# Altium schematic sheet ASCII_09_FPGA_banks_5_6_7_8.SchDoc: FPGA banks 5, 6, 7, 8
size A3; Organization: Lime Microsystems; Address1: Surrey Tech Centre; Address2: Guildford GU2 7YG; Address3: Surrey; Address4: United Kingdom; Revision: v1.4s; SheetNumber: 9; SheetTotal: 15
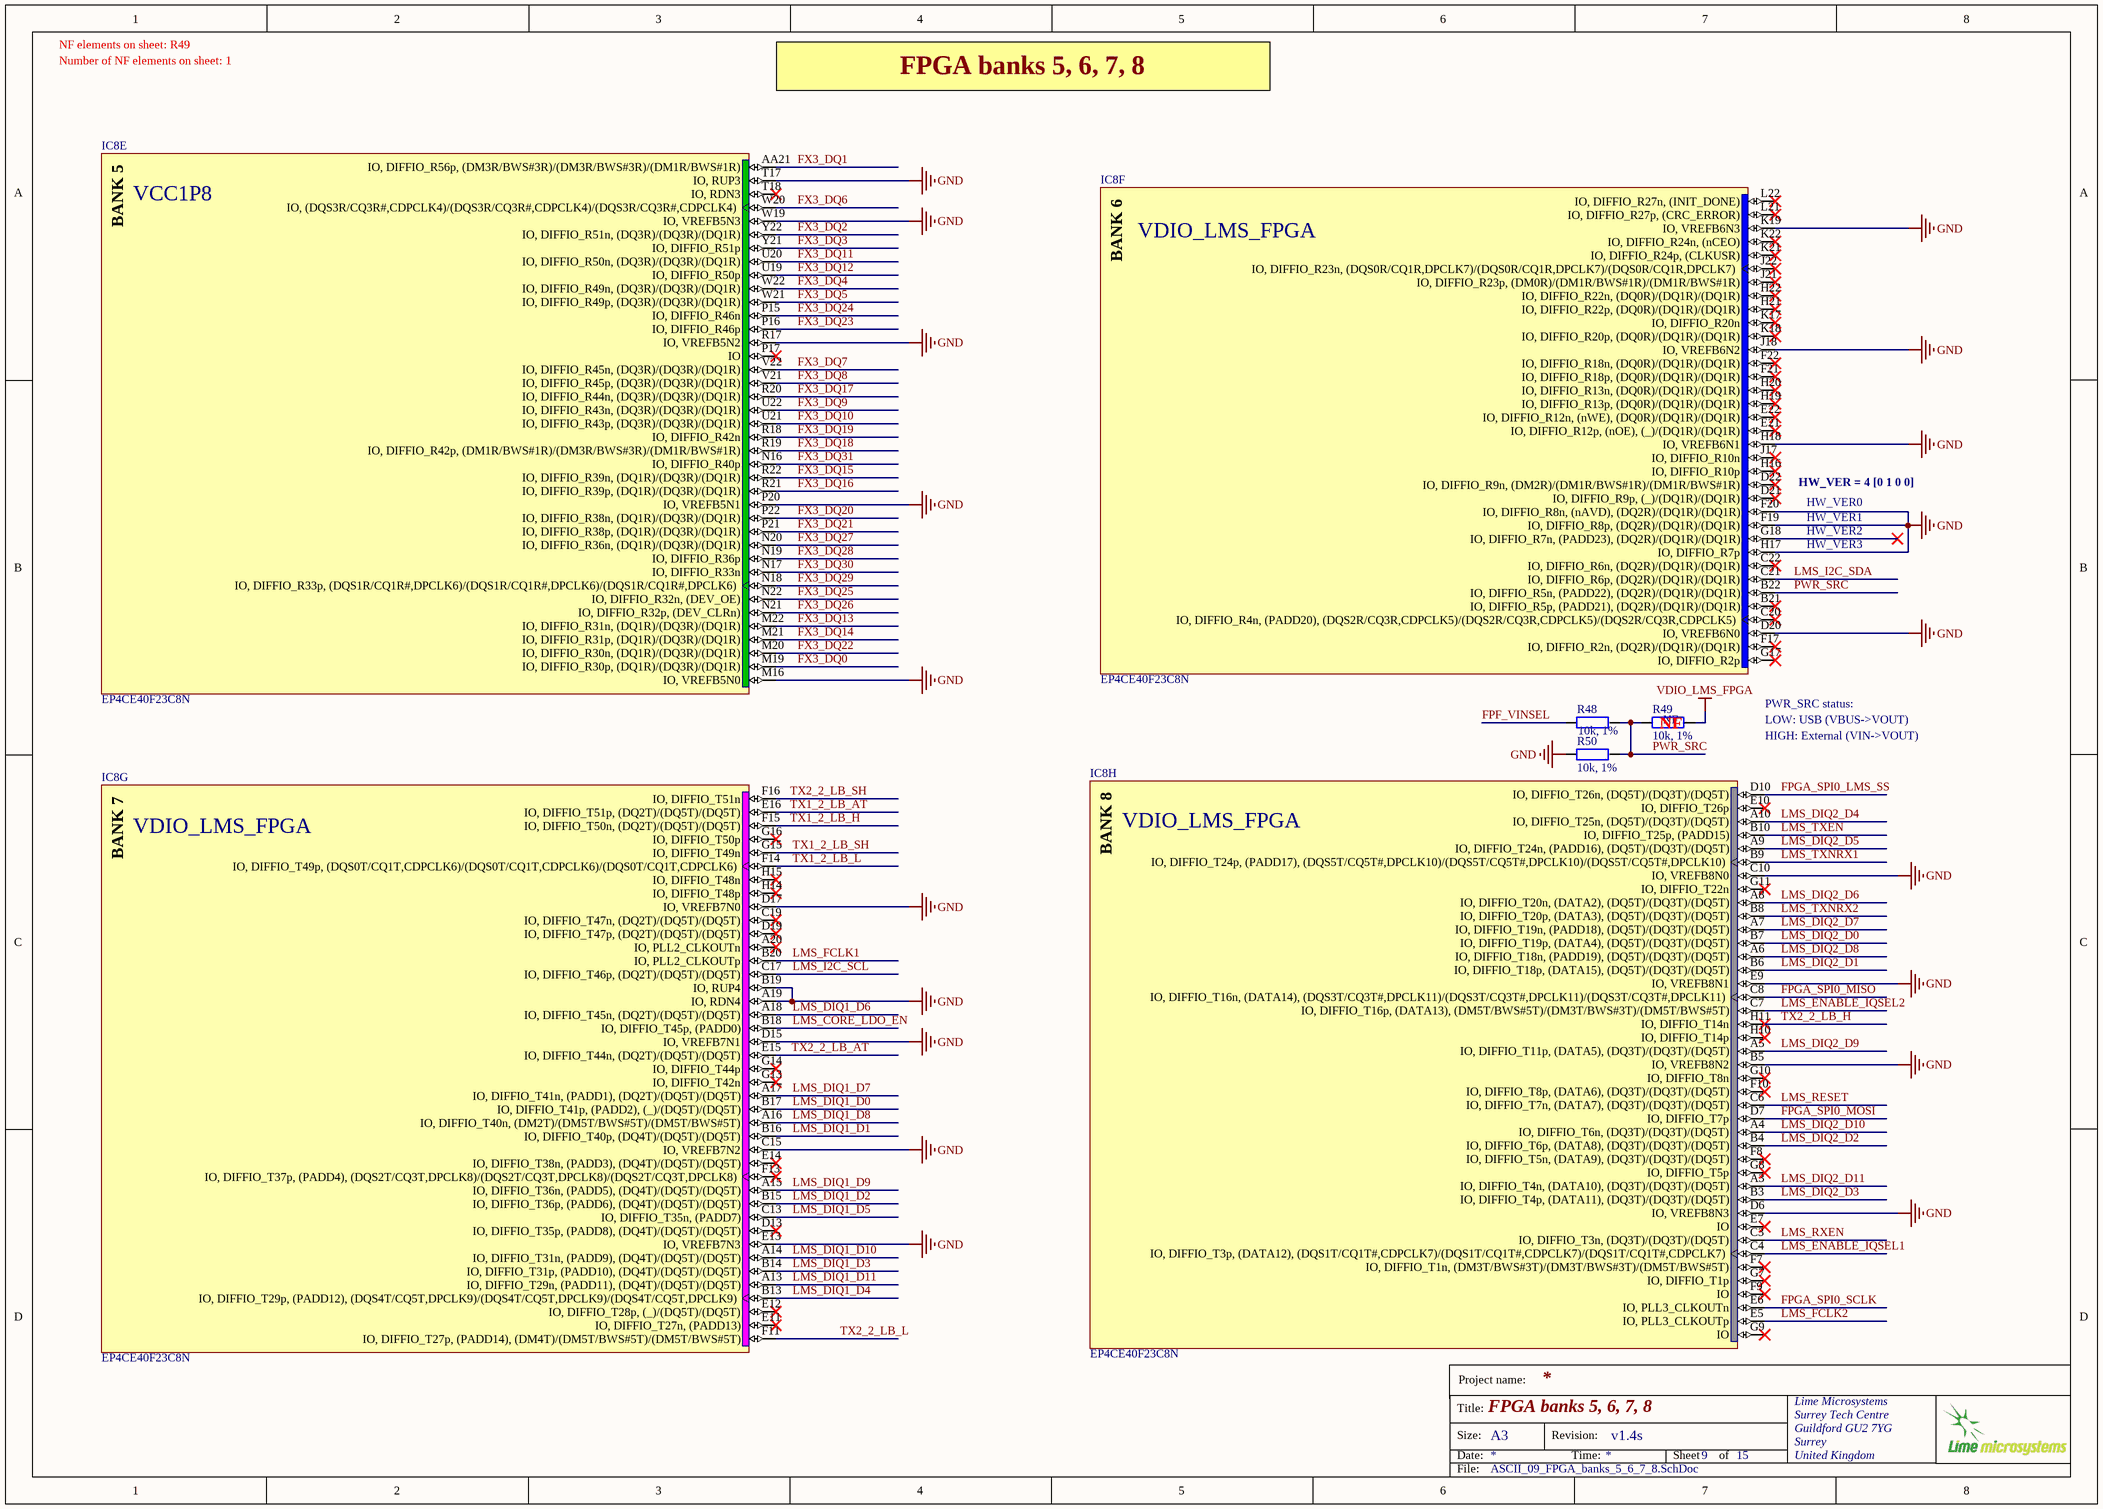
[diagram p0: ASCII_09_FPGA_banks_5_6_7_8.SchDoc]

## Parts
IC8  EP4CE40F23C8N  [FBGA484_A-240]  (parts E,F,G,H of 13)
R48  10k, 1%  [RES0402]
R49  10k, 1%  Assembly Info: NF  [RES0402]
R50  10k, 1%  [RES0402]

## Nets
GND: IC8.A19(IO,_RDN4) IC8.B5(IO,_VREFB8N2) IC8.B19(IO,_RUP4) IC8.C10(IO,_VREFB8N0) IC8.C15(IO,_VREFB7N2) IC8.D6(IO,_VREFB8N3) IC8.D15(IO,_VREFB7N1) IC8.D17(IO,_VREFB7N0) IC8.D20(IO,_VREFB6N0) IC8.E9(IO,_VREFB8N1) IC8.E13(IO,_VREFB7N3) IC8.F19(IO,_DIFFIO_R8p,_(DQ2R)/(DQ1R)/(DQ1R)) IC8.F20(IO,_DIFFIO_R8n,_(nAVD),_(DQ2R)/(DQ1R)/(DQ1R)) IC8.H17(IO,_DIFFIO_R7p) IC8.H18(IO,_VREFB6N1) IC8.J18(IO,_VREFB6N2) IC8.K19(IO,_VREFB6N3) IC8.M16(IO,_VREFB5N0) IC8.P20(IO,_VREFB5N1) IC8.R17(IO,_VREFB5N2) IC8.T17(IO,_RUP3) IC8.W19(IO,_VREFB5N3) R50.1
VDIO_LMS_FPGA: R49.2
FPF_VINSEL: R48.1
FPGA_SPI0_LMS_SS: IC8.D10(IO,_DIFFIO_T26n,_(DQ5T)/(DQ3T)/(DQ5T))
FPGA_SPI0_MISO: IC8.C8(IO,_DIFFIO_T16n,_(DATA14),_(DQS3T/CQ3T#,DPCLK11)/(DQS3T/CQ3T#,DPCLK11)/(DQS3T/CQ3T#,DPCLK11))
FPGA_SPI0_MOSI: IC8.D7(IO,_DIFFIO_T7p)
FPGA_SPI0_SCLK: IC8.E6(IO,_PLL3_CLKOUTn)
FX3_DQ0: IC8.M19(IO,_DIFFIO_R30p,_(DQ1R)/(DQ3R)/(DQ1R))
FX3_DQ1: IC8.AA21(IO,_DIFFIO_R56p,_(DM3R/BWS#3R)/(DM3R/BWS#3R)/(DM1R/BWS#1R))
FX3_DQ2: IC8.Y22(IO,_DIFFIO_R51n,_(DQ3R)/(DQ3R)/(DQ1R))
FX3_DQ3: IC8.Y21(IO,_DIFFIO_R51p)
FX3_DQ4: IC8.W22(IO,_DIFFIO_R49n,_(DQ3R)/(DQ3R)/(DQ1R))
FX3_DQ5: IC8.W21(IO,_DIFFIO_R49p,_(DQ3R)/(DQ3R)/(DQ1R))
FX3_DQ6: IC8.W20(IO,_(DQS3R/CQ3R#,CDPCLK4)/(DQS3R/CQ3R#,CDPCLK4)/(DQS3R/CQ3R#,CDPCLK4))
FX3_DQ7: IC8.V22(IO,_DIFFIO_R45n,_(DQ3R)/(DQ3R)/(DQ1R))
FX3_DQ8: IC8.V21(IO,_DIFFIO_R45p,_(DQ3R)/(DQ3R)/(DQ1R))
FX3_DQ9: IC8.U22(IO,_DIFFIO_R43n,_(DQ3R)/(DQ3R)/(DQ1R))
FX3_DQ10: IC8.U21(IO,_DIFFIO_R43p,_(DQ3R)/(DQ3R)/(DQ1R))
FX3_DQ11: IC8.U20(IO,_DIFFIO_R50n,_(DQ3R)/(DQ3R)/(DQ1R))
FX3_DQ12: IC8.U19(IO,_DIFFIO_R50p)
FX3_DQ13: IC8.M22(IO,_DIFFIO_R31n,_(DQ1R)/(DQ3R)/(DQ1R))
FX3_DQ14: IC8.M21(IO,_DIFFIO_R31p,_(DQ1R)/(DQ3R)/(DQ1R))
FX3_DQ15: IC8.R22(IO,_DIFFIO_R39n,_(DQ1R)/(DQ3R)/(DQ1R))
FX3_DQ16: IC8.R21(IO,_DIFFIO_R39p,_(DQ1R)/(DQ3R)/(DQ1R))
FX3_DQ17: IC8.R20(IO,_DIFFIO_R44n,_(DQ3R)/(DQ3R)/(DQ1R))
FX3_DQ18: IC8.R19(IO,_DIFFIO_R42p,_(DM1R/BWS#1R)/(DM3R/BWS#3R)/(DM1R/BWS#1R))
FX3_DQ19: IC8.R18(IO,_DIFFIO_R42n)
FX3_DQ20: IC8.P22(IO,_DIFFIO_R38n,_(DQ1R)/(DQ3R)/(DQ1R))
FX3_DQ21: IC8.P21(IO,_DIFFIO_R38p,_(DQ1R)/(DQ3R)/(DQ1R))
FX3_DQ22: IC8.M20(IO,_DIFFIO_R30n,_(DQ1R)/(DQ3R)/(DQ1R))
FX3_DQ23: IC8.P16(IO,_DIFFIO_R46p)
FX3_DQ24: IC8.P15(IO,_DIFFIO_R46n)
FX3_DQ25: IC8.N22(IO,_DIFFIO_R32n,_(DEV_OE))
FX3_DQ26: IC8.N21(IO,_DIFFIO_R32p,_(DEV_CLRn))
FX3_DQ27: IC8.N20(IO,_DIFFIO_R36n,_(DQ1R)/(DQ3R)/(DQ1R))
FX3_DQ28: IC8.N19(IO,_DIFFIO_R36p)
FX3_DQ29: IC8.N18(IO,_DIFFIO_R33p,_(DQS1R/CQ1R#,DPCLK6)/(DQS1R/CQ1R#,DPCLK6)/(DQS1R/CQ1R#,DPCLK6))
FX3_DQ30: IC8.N17(IO,_DIFFIO_R33n)
FX3_DQ31: IC8.N16(IO,_DIFFIO_R40p)
LMS_CORE_LDO_EN: IC8.B18(IO,_DIFFIO_T45p,_(PADD0))
LMS_DIQ1_D0: IC8.B17(IO,_DIFFIO_T41p,_(PADD2),_(_)/(DQ5T)/(DQ5T))
LMS_DIQ1_D1: IC8.B16(IO,_DIFFIO_T40p,_(DQ4T)/(DQ5T)/(DQ5T))
LMS_DIQ1_D2: IC8.B15(IO,_DIFFIO_T36p,_(PADD6),_(DQ4T)/(DQ5T)/(DQ5T))
LMS_DIQ1_D3: IC8.B14(IO,_DIFFIO_T31p,_(PADD10),_(DQ4T)/(DQ5T)/(DQ5T))
LMS_DIQ1_D4: IC8.B13(IO,_DIFFIO_T29p,_(PADD12),_(DQS4T/CQ5T,DPCLK9)/(DQS4T/CQ5T,DPCLK9)/(DQS4T/CQ5T,DPCLK9))
LMS_DIQ1_D5: IC8.C13(IO,_DIFFIO_T35n,_(PADD7))
LMS_DIQ1_D6: IC8.A18(IO,_DIFFIO_T45n,_(DQ2T)/(DQ5T)/(DQ5T))
LMS_DIQ1_D7: IC8.A17(IO,_DIFFIO_T41n,_(PADD1),_(DQ2T)/(DQ5T)/(DQ5T))
LMS_DIQ1_D8: IC8.A16(IO,_DIFFIO_T40n,_(DM2T)/(DM5T/BWS#5T)/(DM5T/BWS#5T))
LMS_DIQ1_D9: IC8.A15(IO,_DIFFIO_T36n,_(PADD5),_(DQ4T)/(DQ5T)/(DQ5T))
LMS_DIQ1_D10: IC8.A14(IO,_DIFFIO_T31n,_(PADD9),_(DQ4T)/(DQ5T)/(DQ5T))
LMS_DIQ1_D11: IC8.A13(IO,_DIFFIO_T29n,_(PADD11),_(DQ4T)/(DQ5T)/(DQ5T))
LMS_DIQ2_D0: IC8.B7(IO,_DIFFIO_T19p,_(DATA4),_(DQ5T)/(DQ3T)/(DQ5T))
LMS_DIQ2_D1: IC8.B6(IO,_DIFFIO_T18p,_(DATA15),_(DQ5T)/(DQ3T)/(DQ5T))
LMS_DIQ2_D2: IC8.B4(IO,_DIFFIO_T6p,_(DATA8),_(DQ3T)/(DQ3T)/(DQ5T))
LMS_DIQ2_D3: IC8.B3(IO,_DIFFIO_T4p,_(DATA11),_(DQ3T)/(DQ3T)/(DQ5T))
LMS_DIQ2_D4: IC8.A10(IO,_DIFFIO_T25n,_(DQ5T)/(DQ3T)/(DQ5T))
LMS_DIQ2_D5: IC8.A9(IO,_DIFFIO_T24n,_(PADD16),_(DQ5T)/(DQ3T)/(DQ5T))
LMS_DIQ2_D6: IC8.A8(IO,_DIFFIO_T20n,_(DATA2),_(DQ5T)/(DQ3T)/(DQ5T))
LMS_DIQ2_D7: IC8.A7(IO,_DIFFIO_T19n,_(PADD18),_(DQ5T)/(DQ3T)/(DQ5T))
LMS_DIQ2_D8: IC8.A6(IO,_DIFFIO_T18n,_(PADD19),_(DQ5T)/(DQ3T)/(DQ5T))
LMS_DIQ2_D9: IC8.A5(IO,_DIFFIO_T11p,_(DATA5),_(DQ3T)/(DQ3T)/(DQ5T))
LMS_DIQ2_D10: IC8.A4(IO,_DIFFIO_T6n,_(DQ3T)/(DQ3T)/(DQ5T))
LMS_DIQ2_D11: IC8.A3(IO,_DIFFIO_T4n,_(DATA10),_(DQ3T)/(DQ3T)/(DQ5T))
LMS_ENABLE_IQSEL1: IC8.C4(IO,_DIFFIO_T3p,_(DATA12),_(DQS1T/CQ1T#,CDPCLK7)/(DQS1T/CQ1T#,CDPCLK7)/(DQS1T/CQ1T#,CDPCLK7))
LMS_ENABLE_IQSEL2: IC8.C7(IO,_DIFFIO_T16p,_(DATA13),_(DM5T/BWS#5T)/(DM3T/BWS#3T)/(DM5T/BWS#5T))
LMS_FCLK1: IC8.B20(IO,_PLL2_CLKOUTp)
LMS_FCLK2: IC8.E5(IO,_PLL3_CLKOUTp)
LMS_I2C_SCL: IC8.C17(IO,_DIFFIO_T46p,_(DQ2T)/(DQ5T)/(DQ5T))
LMS_I2C_SDA: IC8.C21(IO,_DIFFIO_R6p,_(DQ2R)/(DQ1R)/(DQ1R))
LMS_RESET: IC8.C6(IO,_DIFFIO_T7n,_(DATA7),_(DQ3T)/(DQ3T)/(DQ5T))
LMS_RXEN: IC8.C3(IO,_DIFFIO_T3n,_(DQ3T)/(DQ3T)/(DQ5T))
LMS_TXEN: IC8.B10(IO,_DIFFIO_T25p,_(PADD15))
LMS_TXNRX1: IC8.B9(IO,_DIFFIO_T24p,_(PADD17),_(DQS5T/CQ5T#,DPCLK10)/(DQS5T/CQ5T#,DPCLK10)/(DQS5T/CQ5T#,DPCLK10))
LMS_TXNRX2: IC8.B8(IO,_DIFFIO_T20p,_(DATA3),_(DQ5T)/(DQ3T)/(DQ5T))
PWR_SRC: IC8.B22(IO,_DIFFIO_R5n,_(PADD22),_(DQ2R)/(DQ1R)/(DQ1R)) R48.2 R49.1 R50.2
TX1_2_LB_AT: IC8.E16(IO,_DIFFIO_T51p,_(DQ2T)/(DQ5T)/(DQ5T))
TX1_2_LB_H: IC8.F15(IO,_DIFFIO_T50n,_(DQ2T)/(DQ5T)/(DQ5T))
TX1_2_LB_L: IC8.F14(IO,_DIFFIO_T49p,_(DQS0T/CQ1T,CDPCLK6)/(DQS0T/CQ1T,CDPCLK6)/(DQS0T/CQ1T,CDPCLK6))
TX1_2_LB_SH: IC8.G15(IO,_DIFFIO_T49n)
TX2_2_LB_AT: IC8.E15(IO,_DIFFIO_T44n,_(DQ2T)/(DQ5T)/(DQ5T))
TX2_2_LB_H: IC8.H11(IO,_DIFFIO_T14n)
TX2_2_LB_L: IC8.F11(IO,_DIFFIO_T27p,_(PADD14),_(DM4T)/(DM5T/BWS#5T)/(DM5T/BWS#5T))
TX2_2_LB_SH: IC8.F16(IO,_DIFFIO_T51n)

Not connected (* = marked no-connect by the designer): IC8 A20(IO,_PLL2_CLKOUTn)* B21(IO,_DIFFIO_R5p,_(PADD21),_(DQ2R)/(DQ1R)/(DQ1R))* C19(IO,_DIFFIO_T47n,_(DQ2T)/(DQ5T)/(DQ5T))* C20(IO,_DIFFIO_R4n,_(PADD20),_(DQS2R/CQ3R,CDPCLK5)/(DQS2R/CQ3R,CDPCLK5)/(DQS2R/CQ3R,CDPCLK5))* C22(IO,_DIFFIO_R6n,_(DQ2R)/(DQ1R)/(DQ1R))* D13(IO,_DIFFIO_T35p,_(PADD8),_(DQ4T)/(DQ5T)/(DQ5T))* D19(IO,_DIFFIO_T47p,_(DQ2T)/(DQ5T)/(DQ5T))* D21(IO,_DIFFIO_R9p,_(_)/(DQ1R)/(DQ1R))* D22(IO,_DIFFIO_R9n,_(DM2R)/(DM1R/BWS#1R)/(DM1R/BWS#1R))* E7(IO)* E10(IO,_DIFFIO_T26p)* E11(IO,_DIFFIO_T27n,_(PADD13))* E12(IO,_DIFFIO_T28p,_(_)/(DQ5T)/(DQ5T))* E14(IO,_DIFFIO_T38n,_(PADD3),_(DQ4T)/(DQ5T)/(DQ5T))* E21(IO,_DIFFIO_R12p,_(nOE),_(_)/(DQ1R)/(DQ1R))* E22(IO,_DIFFIO_R12n,_(nWE),_(DQ0R)/(DQ1R)/(DQ1R))* F7(IO,_DIFFIO_T1n,_(DM3T/BWS#3T)/(DM3T/BWS#3T)/(DM5T/BWS#5T))* F8(IO,_DIFFIO_T5n,_(DATA9),_(DQ3T)/(DQ3T)/(DQ5T))* F9(IO)* F10(IO,_DIFFIO_T8p,_(DATA6),_(DQ3T)/(DQ3T)/(DQ5T))* F13(IO,_DIFFIO_T37p,_(PADD4),_(DQS2T/CQ3T,DPCLK8)/(DQS2T/CQ3T,DPCLK8)/(DQS2T/CQ3T,DPCLK8))* F17(IO,_DIFFIO_R2n,_(DQ2R)/(DQ1R)/(DQ1R))* F21(IO,_DIFFIO_R18p,_(DQ0R)/(DQ1R)/(DQ1R))* F22(IO,_DIFFIO_R18n,_(DQ0R)/(DQ1R)/(DQ1R))* G7(IO,_DIFFIO_T1p)* G8(IO,_DIFFIO_T5p)* G9(IO)* G10(IO,_DIFFIO_T8n)* G11(IO,_DIFFIO_T22n)* G13(IO,_DIFFIO_T42n)* G14(IO,_DIFFIO_T44p)* G16(IO,_DIFFIO_T50p)* G17(IO,_DIFFIO_R2p)* G18(IO,_DIFFIO_R7n,_(PADD23),_(DQ2R)/(DQ1R)/(DQ1R))* H10(IO,_DIFFIO_T14p)* H14(IO,_DIFFIO_T48p)* H15(IO,_DIFFIO_T48n)* H16(IO,_DIFFIO_R10p)* H19(IO,_DIFFIO_R13p,_(DQ0R)/(DQ1R)/(DQ1R))* H20(IO,_DIFFIO_R13n,_(DQ0R)/(DQ1R)/(DQ1R))* H21(IO,_DIFFIO_R22p,_(DQ0R)/(DQ1R)/(DQ1R))* H22(IO,_DIFFIO_R22n,_(DQ0R)/(DQ1R)/(DQ1R))* J17(IO,_DIFFIO_R10n)* J21(IO,_DIFFIO_R23p,_(DM0R)/(DM1R/BWS#1R)/(DM1R/BWS#1R))* J22(IO,_DIFFIO_R23n,_(DQS0R/CQ1R,DPCLK7)/(DQS0R/CQ1R,DPCLK7)/(DQS0R/CQ1R,DPCLK7))* K17(IO,_DIFFIO_R20n)* K18(IO,_DIFFIO_R20p,_(DQ0R)/(DQ1R)/(DQ1R))* K21(IO,_DIFFIO_R24p,_(CLKUSR))* K22(IO,_DIFFIO_R24n,_(nCEO))* L21(IO,_DIFFIO_R27p,_(CRC_ERROR))* L22(IO,_DIFFIO_R27n,_(INIT_DONE))* P17(IO)* T18(IO,_RDN3)*

## Notes on the sheet
- NF elements on sheet: R49
- Number of NF elements on sheet: 1
- FPGA banks 5, 6, 7, 8
- VCC1P8
- VDIO_LMS_FPGA
- (near IC8) HW_VER = 4 [0 1 0 0]
- HW_VER0
- HW_VER1
- HW_VER2
- HW_VER3
- (near IC8) PWR_SRC status:
- (near R49) NF
- HIGH: External (VIN->VOUT)
- LOW: USB (VBUS->VOUT)
- Project name:
- Title:
- Size:
- Date:
- A3
- Revision:
- Time:
- Sheet
- of
- File:
- (in symbol EP4CE40F23C7N, part E) BANK 5
- (in symbol EP4CE40F23C7N, part F) BANK 6
- (in symbol EP4CE40F23C7N, part G) BANK 7
- (in symbol EP4CE40F23C7N, part H) BANK 8

## Library data of the parts
IC8 = EP4CE40F23C7N: IC FPGA 328 I/O 484FBGA; Manufacturer: Altera; Number of I/O: 328; Number of LABs/CLBs: 2475; Number of Logic Elements/Cells: 39600; Total RAM Bits: 1161216; Voltage - Supply: 1.15 V ~ 1.25 V; DatasheetVersion: ver1.6, Nov-2011; PackageDescription: 484-Pin FineLine Ball Grid Array (FBGA) - Wire Bond - A:2.40; Code_JEDEC: MS-034-AAJ-1; ComponentLink1Description: Manufacturer URL; ComponentLink1URL: http://www.altera.com/; ComponentLink2Description: Handbook; ComponentLink2URL: http://www.altera.com/literature/hb/cyclone-iv/cyclone4-handbook.pdf; ComponentLink3Description: Pinout; ComponentLink3URL: http://www.altera.com/literature/lit-dp.jsp?category=cyc%204&showspreadsheet=y; ComponentLink4Description: Package Specification; ComponentLink4URL: http://www.altera.com/devicepackaging/04R00247-02.pdf; Category: Integrated Circuits (ICs); Manufacturer Part Number 1: EP4CE40F23C8N; Mounting Type: Surface Mount; Number of Gates: -; Operating Temperature: 0°C ~ 85°C; Package / Case: 484-BGA; RoHS: RoHS Compliant; Supplier 1: Digi-Key; Supplier Device Package: 484-FBGA (23x23); Supplier Part Number 1: 544-2811-ND; Part Description: IC FPGA 328 I/O 484FBGA
R48-R50 = Res_0402: Manufacturer: Yageo; Manufacturer Part Number 1: RC0402FR-0710KL; Part Description: RES SMD 10K OHM 1% 1/16W 0402; Temperature Coefficient: ±100ppm/°C; Power (Watts): 0.063W, 1/16W; Value: 10k, 1%; Supplier 1: Digi-Key; Supplier Part Number 1: 311-10.0KLRTR-ND; Resistance (Ohms): 10k; Packaging: Tape & Reel (TR); RoHS: RoHS Compliant; Package / Case: 0402 (1005 Metric); Tolerance: ±1%; Operating Temperature: -55°C ~ 155°C; Size / Dimension: 0.039" L x 0.020" W (1.00mm x 0.50mm); Number of Terminations: 2; Category: Resistors; Height: 0.016" (0.40mm); Supplier Device Package: 0402; Features: Moisture Resistant; Composition: Thick Film